# Altium schematic sheet Clock_Buffer.SchDoc
size A4; SheetNumber: 1; SheetTotal: 1
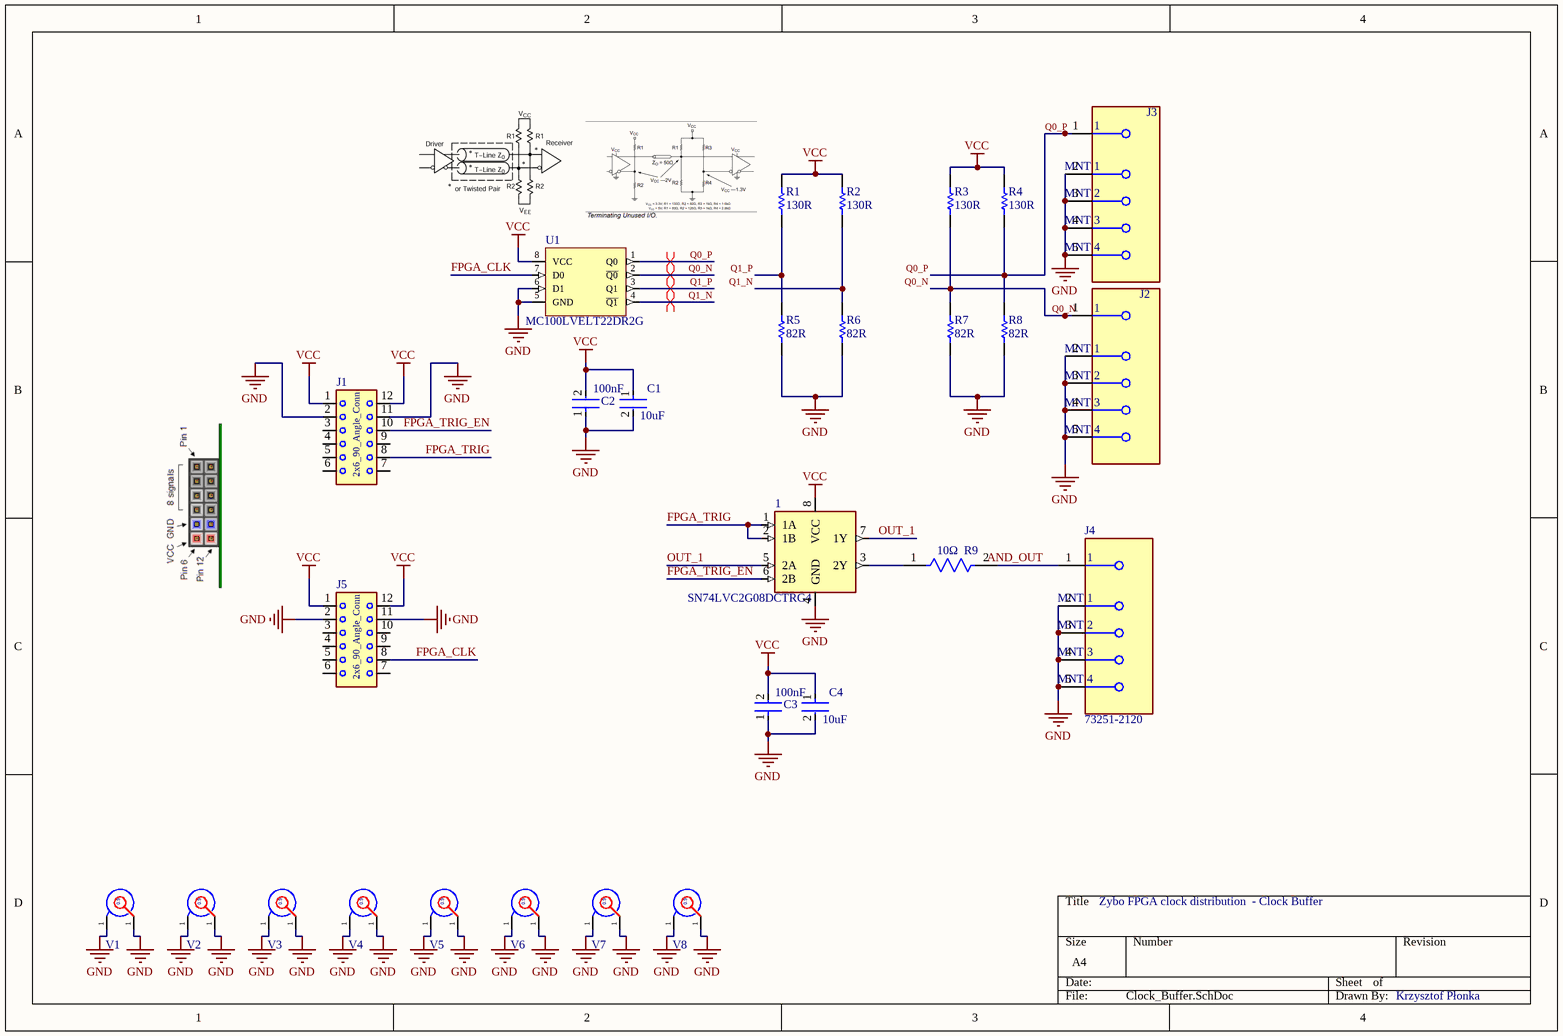
[diagram p0: Clock_Buffer.SchDoc]

## Parts
1  SN74LVC2G08DCTRG4  [8-Pin SM8]
C1  value 10uF  [FP-GRM21B-0_2-e0_2_0_7-IPC_B]  (hidden comment: GRM21BZ71E106KE15K)
C2  value 100nF  [FP-GRM033-0_03-IPC_A]  (hidden comment: GRM033Z71C104KE14J)
C3  value 100nF  [FP-GRM033-0_03-IPC_A]  (hidden comment: GRM033Z71C104KE14J)
C4  value 10uF  [FP-GRM21B-0_2-e0_2_0_7-IPC_B]  (hidden comment: GRM21BZ71E106KE15K)
J1  2X6_Male_90_Angle_Conn  [2X6_Male_90_Angle_Conn]  (value not drawn)
J2  73251-2120  [FP-73251-2120-MFG]  (value not drawn)
J3  73251-2120  [FP-73251-2120-MFG]  (value not drawn)
J4  73251-2120  [FP-73251-2120-MFG]
J5  2X6_Male_90_Angle_Conn  [2X6_Male_90_Angle_Conn]  (value not drawn)
R1  value 130R  [RESC0603X28X15ML05T05]  (hidden comment: CRCW0201130RFNED)
R2  value 130R  [RESC0603X28X15ML05T05]  (hidden comment: CRCW0201130RFNED)
R3  value 130R  [RESC0603X28X15ML05T05]  (hidden comment: CRCW0201130RFNED)
R4  value 130R  [RESC0603X28X15ML05T05]  (hidden comment: CRCW0201130RFNED)
R5  value 82R  [RESC0603X28X15ML05T05]  (hidden comment: CRCW020182R0FNED)
R6  value 82R  [RESC0603X28X15ML05T05]  (hidden comment: CRCW020182R0FNED)
R7  value 82R  [RESC0603X28X15ML05T05]  (hidden comment: CRCW020182R0FNED)
R8  value 82R  [RESC0603X28X15ML05T05]  (hidden comment: CRCW020182R0FNED)
R9  Resistance: 10Ω  [FP-ERJ1GN-MFG]  (hidden comment: ERJ-1GNF10R0C)
U1  MC100LVELT22DR2G  [MC100LVELT22DR2G]
V1  Copper_Via_09  [Copper_Via_09]  (value not drawn)
V2  Copper_Via_09  [Copper_Via_09]  (value not drawn)
V3  Copper_Via_09  [Copper_Via_09]  (value not drawn)
V4  Copper_Via_09  [Copper_Via_09]  (value not drawn)
V5  Copper_Via_09  [Copper_Via_09]  (value not drawn)
V6  Copper_Via_09  [Copper_Via_09]  (value not drawn)
V7  Copper_Via_09  [Copper_Via_09]  (value not drawn)
V8  Copper_Via_09  [Copper_Via_09]  (value not drawn)

## Nets
GND: 1.4(GND) C1.2 C2.1 C3.1 C4.2 J1.2 J1.11 J2.2(MNT_1) J2.3(MNT_2) J2.4(MNT_3) J2.5(MNT_4) J3.2(MNT_1) J3.3(MNT_2) J3.4(MNT_3) J3.5(MNT_4) J4.2(MNT_1) J4.3(MNT_2) J4.4(MNT_3) J4.5(MNT_4) J5.2 J5.11 R5.1 R6.1 R7.1 R8.1 U1.5(GND) U1.6(D1) V1.1 V2.1 V3.1 V4.1 V5.1 V6.1 V7.1 V8.1
VCC: 1.8(VCC) C1.1 C2.2 C3.2 C4.1 J1.1 J1.12 J5.1 J5.12 R1.2 R2.2 R3.2 R4.2 U1.8(VCC)
AND_OUT: J4.1 R9.2
FPGA_CLK: J5.8 U1.7(D0)
FPGA_TRIG: 1.1(1A) 1.2(1B) J1.8
FPGA_TRIG_EN: 1.6(2B) J1.10
OUT_1: 1.5(2A) 1.7(1Y)
Q0_N: J2.1 R3.1 R7.2 U1.2(~{Q0})
Q0_P: J3.1 R4.1 R8.2 U1.1(Q0)
Q1_N: R2.1 R6.2 U1.4(~{Q1})
Q1_P: R1.1 R5.2 U1.3(Q1)
Net1_3: 1.3(2Y) R9.1

Not connected (* = marked no-connect by the designer): J1 3 4 5 6 7 9; J5 3 4 5 6 7 9 10

## Layout directives
differential pair: Q0_N, Q0_P, Q1_N, Q1_P

## Notes on the sheet
- Zybo FPGA clock distribution  - Clock Buffer
- Krzysztof Płonka
- (in symbol 2X6_Male_90_Angle_Conn) 2x6_90_Angle_Conn
- (in symbol Copper_Via_09) 0.9

## Library data of the parts
C1 C4 = CMP-06035-042430-1: Chip Multilayer Ceramic Capacitors for General Purpose, 0805, 10uF, X7R, 15%, 10%, 25V; Case/Package: 0805
C2 C3 = CMP-06035-043202-1: Chip Multilayer Ceramic Capacitors for General Purpose, 0201, 0.10uF, X7R, 15%, 10%, 16V
J1 J5 = 2X6_Male_90_Angle_Conn: 2x16 right angle connector
J2-J4 = CMP-04764-000015-1: CONN SMA JACK STR 50OHM EDGE MNT; Gender: Female; Plating: Gold; Impedance: 50R; Body Material: Brass; Polarity: Standard; Mount: Edge; Contact Plating: Gold; Orientation: Straight; Lead Free: Lead Free; Contact Material: Copper; Termination: Solder; RoHS Compliant: Yes; Body Plating: Gold; Operating Frequency: N/A; Connector Type: SMA; Case/Package: SMA; Series: 73251; Halogen Free: Low Halogen; Radiation Hardening: No; Packaging: Bulk; Package Quantity: 1600
R1-R4 = CMP-2004-00084-1: Manufacturer: Vishay Dale; Part Number: CRCW0201130RFNED
R5-R8 = CMP-2004-00897-1: Manufacturer: Vishay Dale; Part Number: CRCW020182R0FNED
R9 = CMP-2004-03448-2: NexarPartId: 55419705; Power Rating: 50mW; Voltage Rating (DC): 25V; Tolerance: 1%; Temperature Coefficient: 200ppm/°C; Number of Terminations: 2; REACH SVHC: No SVHC; Length: 600µm; Contact Plating: Tin; Radiation Hardening: No; Number of Pins: 2; Voltage Rating: 25V; Schedule B: 8533210045, 8533210045; Lifecycle Status: Production; Min Operating Temperature: -55°C; RoHS: Compliant; Composition: Thick Film; Case Code (Metric): 0603; Mount: Surface Mount; Width: 304.8µm; Height: 254µm; Working Voltage: 25V; Termination: SMD/SMT; Lead Free: Lead Free; Max Operating Temperature: 125°C; Max Power Dissipation: 50mW; Case/Package: 0201; Packaging: Cut Tape; Case Code (Imperial): 0201; Weight: 170.097139µg
U1 = MC100LVELT22DR2G: SOIC-8, LVCMOS/LVTTL to LVPECL; ComponentLink1Description: Link; ComponentLink1URL: https://www.mouser.pl/ProductDetail/onsemi/MC100LVELT22DR2G?qs=zorda86t5M8%2FJ3oAMFoeaQ%3D%3D
V1-V8 = Copper_Via_09: Copper Via 0.9mm hole